# EAGLE design oes-r2 (EAGLE 6.4)
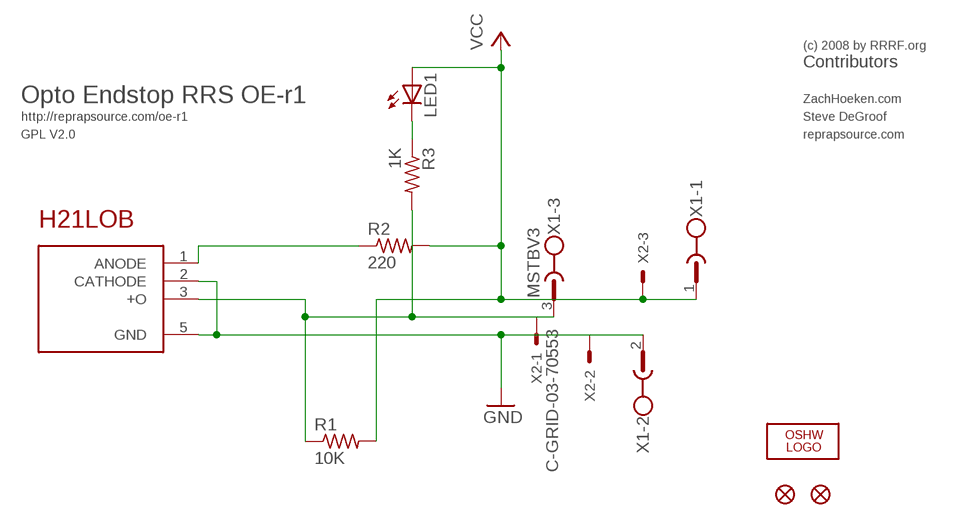
[diagram p0: schematic, sheet 1]

## Parts
JP1  FIDUCIAL1X2  [FIDUCIAL-1X2]
JP2  FIDUCIAL1X2  [FIDUCIAL-1X2]
LED1  LEDCHIP-LED0805  [CHIP-LED0805]
LOGO1  OSHW_LOGO_6MILX0100-NT  [OSHW_6X100_NOTEXT]
R1  10K  R-US_R0603  [R0603]
R2  220  R-US_R0603  [R0603]
R3  1K  R-US_R0603  [R0603]
U1  H21LOB  [H21]
X1  MSTBV3  [MSTBV3]
X2  C-GRID-03-70553  [70553-03]

## Nets
GND: U1.2(CATHODE) U1.5(GND) X1.2 X2.2
N$1: LED1.C R3.1
N$2: R1.1 R3.2 U1.3(+O) X1.3 X2.1
N$3: R2.1 U1.1(ANODE)
VCC: LED1.A R1.2 R2.2 X1.1 X2.3

## Notes on the sheet
- (c) 2008 by RRRF.org
- Contributors
- Opto Endstop RRS OE-r1 | ZachHoeken.com
- http://reprapsource.com/oe-r1 | Steve DeGroof
- GPL V2.0 | reprapsource.com

## Library data of the parts
JP1 JP2 = SparkFun:FIDUCIAL: Fiducial Alignment Points Various fiducial points for machine vision alignment.
LED1 = led:LED: LED OSRAM: - CHIPLED LG R971, LG N971, LY N971, LG Q971, LY Q971, LO R971, LY R971 LH N974, LH R974 LS Q976, LO Q976, LY Q976 LO Q996 - Hyper CHIPLED LW Q18S LB Q993, LB Q99A, LB R99A - SideLED LS A670, LO A670, LY A670, LG A670, LP A670 LB A673, LV A673, LT A673, LW A673 LH A674 LY A675 LS A676, LA A676, LO A676, LY A676, LW A676 LS A679, LY A679, LG A679 - Hyper Micro SIDELED® LS Y876, LA Y876, LO Y876, LY Y876 LT Y87S - SmartLED LW L88C, LW L88S LB L89C, LB L89S, LG L890 LS L89K, LO L89K, LY L89K LS L896, LA L896, LO L896, LY L896 - TOPLED LS T670, LO T670, LY T670, LG T670, LP T670 LSG T670, LSP T670, LSY T670, LOP T670, LYG T670 LG T671, LOG T671, LSG T671 LB T673, LV T673, LT T673, LW T673 LH T674 LS T676, LA T676, LO T676, LY T676, LB T676, LH T676, LSB T676, LW T676 LB T67C, LV T67C, LT T67C, LS T67K, LO T67K, LY T67K, LW E67C LS E67B, LA E67B, LO E67B, LY E67B, LB E67C, LV E67C, LT E67C LW T67C LS T679, LY T679, LG T679 LS T770, LO T770, LY T770, LG T770, LP T770 LB T773, LV T773, LT T773, LW T773 LH T774 LS E675, LA E675, LY E675, LS T675 LS T776, LA T776, LO T776, LY T776, LB T776 LHGB T686 LT T68C, LB T68C - Hyper Mini TOPLED® LB M676 - Mini TOPLED Santana® LG M470 LS M47K, LO M47K, LY M47K Source: http://www.osram.convergy.de LUXEON: - LUMILED® LXK2-PW12-R00, LXK2-PW12-S00, LXK2-PW14-U00, LXK2-PW14-V00 LXK2-PM12-R00, LXK2-PM12-S00, LXK2-PM14-U00 LXK2-PE12-Q00, LXK2-PE12-R00, LXK2-PE12-S00, LXK2-PE14-T00, LXK2-PE14-U00 LXK2-PB12-K00, LXK2-PB12-L00, LXK2-PB12-M00, LXK2-PB14-N00, LXK2-PB14-P00, LXK2-PB14-Q00 LXK2-PR12-L00, LXK2-PR12-M00, LXK2-PR14-Q00, LXK2-PR14-R00 LXK2-PD12-Q00, LXK2-PD12-R00, LXK2-PD12-S00 LXK2-PH12-R00, LXK2-PH12-S00 LXK2-PL12-P00, LXK2-PL12-Q00, LXK2-PL12-R00 Source: www.luxeon.com KINGBRIGHT: KA-3528ASYC Source: www.kingbright.com
LOGO1 = ohw-logo:OSHW_LOGO_6MIL
R1-R3 = resistor:R-US_: RESISTOR, American symbol
U1 = reprap:H21LOB
X1 = con-phoenix-508:MSTBV3: PHOENIX; MPN: MSTBV 2,5/3-GF-5.08; OC_FARNELL: 1792793; OC_NEWARK: 69R9846
X2 = con-molex:C-GRID-03: CONNECTOR wire to board 2.54 mm (0.100") pitch header; OC_FARNELL: unknown; OC_NEWARK: unknown

## Net classes
0 default: width 0.203 mm, clearance 0.203 mm

## Board
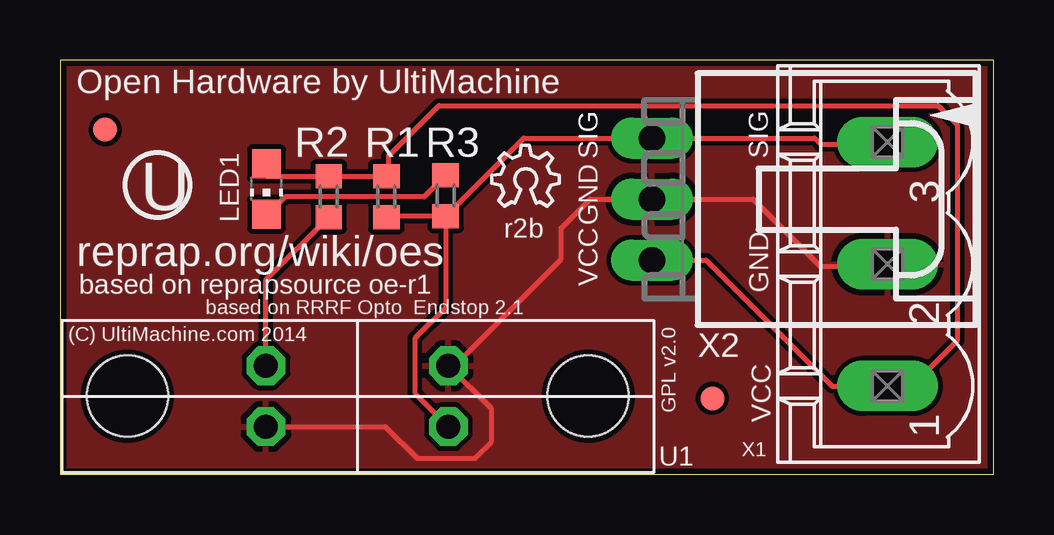
[diagram p1: board, top side]
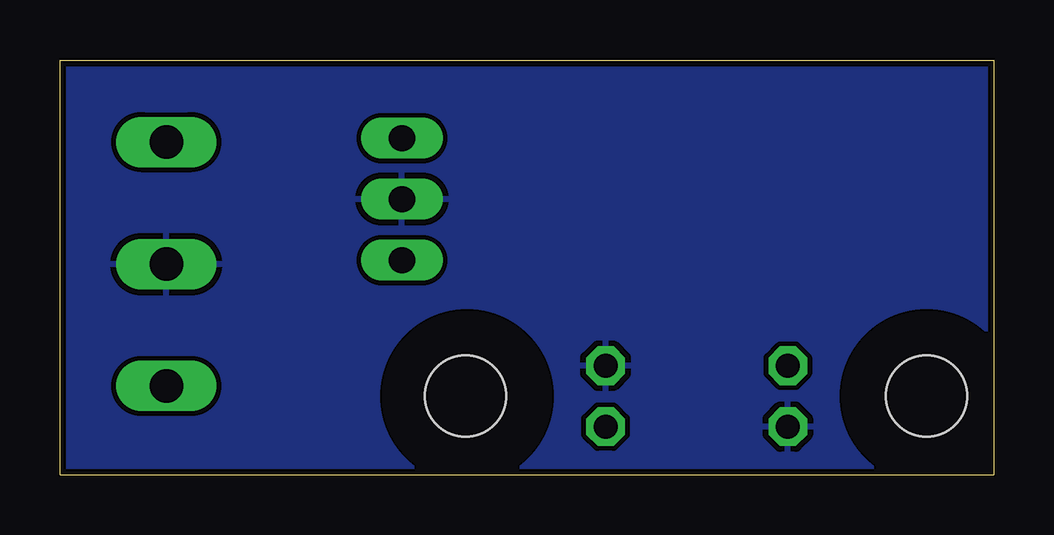
[diagram p2: board, bottom side, seen from below]

Size 38.91 x 17.27 mm. Coordinates in mm from the lower left corner, seen from the top.
Outline: 38.91,0 38.91,17.27 0,17.27 0,0 38.91,0
Copper layers (1*16): Top 0.035mm / dielectric 1.5mm / Bottom 0.035mm
Design rules "GoldPhoenix": minimum track width 7mil, minimum drill 15mil, track to track 7mil, track to pad 7mil, pad to pad 7mil, via to via 7mil, smd to smd 7mil, copper to edge 10mil, drill to drill 8mil, minimum pad ring 12mil, minimum via ring 7mil, stop-mask expansion 4mil, vias tented up to drill 25mil, thermal gap 10mil

### Footprints (pad centres in the part's own frame; a part is rotated, then mirrored left to right if it is on the bottom)
FIDUCIAL-1X2 = smd 1 x 1: 1 0,0
CHIP-LED0805 = smd 1.2 x 1.2: A 0,-1.05; C 0,1.05
R0603 = smd 1 x 1.1: 1 -0.85,0; 2 0.85,0
H21 = drill 1 octagon: 1 -3.8,1.27; 2 -3.8,-1.27; 3 3.8,-1.27; 5 3.8,1.27 | hole 3.378: -9.576,0; 9.627,0
MSTBV3 = drill 1.397 long: 1 -5.08,0; 2 0,0; 3 5.08,0
70553-03 = drill 1.092 long: 1 -2.54,-7.62; 2 0,-7.62; 3 2.54,-7.62

### Placement (x,y rotation side)
JP1  1.88,14.37 0 top
JP2  27.18,3.17 0 top
LED1  8.6,11.9 180 top
LOGO1  17.98,11.17 0 top
R1  13.6,11.57 90 top
R2  11.2,11.57 90 top
R3  16.07,11.62 270 top
U1  12.38,3.26 0 top
X1  34.48,8.77 90 top
X2  32.28,11.47 270 top

### Tracks (layer width: path | path; a pad name or v marks a point on that pad's centre or on a via)
GND
  Top 0.203: U1.2 13.56,1.99 14.88,0.67 17.28,0.67 17.98,1.37 17.98,2.73 U1.5 16.45,4.54 20.88,8.97 20.88,10.27 22.08,11.47 X2.2 28.88,11.47 31.68,8.67 34.38,8.67 X1.2
  pour Top: 0.08,17.27 0.08,0.07 38.98,0.07 38.98,17.27
  pour Bottom: 0.08,17.27 0.08,0.07 38.98,0.07 38.98,17.27
N$1
  Top 0.203: R3.1 15.18,11.57 9.38,11.57 8.4,10.59 LED1.C
N$2
  Top 0.203: R3.2 13.65,10.77 R1.1 | R3.2 16.07,6.96 14.78,5.67 14.78,3.39 U1.3 | R3.2 19.32,14.01 X2.1 31.44,14.01 31.68,13.77 34.4,13.77 X1.3
N$3
  Top 0.203: U1.1 8.58,8.11 R2.1
VCC
  Top 0.203: LED1.A 8.63,12.42 R2.2 R1.2 13.68,12.5 13.68,13.27 15.78,15.37 36.58,15.37 37.38,14.57 37.38,5.57 35.68,3.87 34.66,3.87 X1.1 34.46,3.67 32.18,3.67 26.92,8.93 X2.3

### Text on the board
tPlace: SIG | SIG | GND | based on reprapsource oe-r1 | VCC | GND | based on RRRF Opto Endstop 2.1 | (C) UltiMachine.com 2014 | GPL v2.0 | VCC
_tsilk: Open Hardware by UltiMachine | U | r2b | reprap.org/wiki/oes